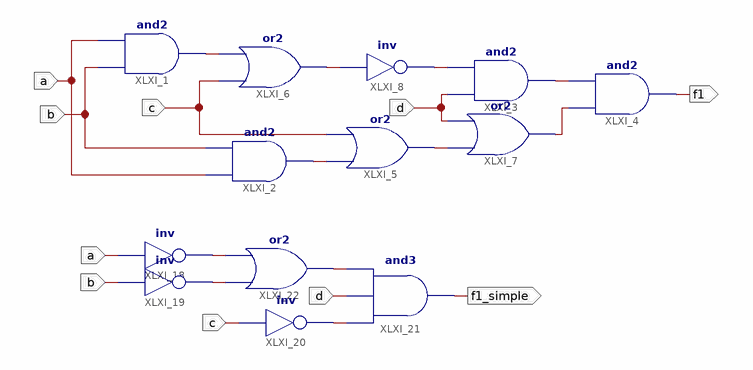
[diagram p0: schematic sheet 1]
// Xilinx ISE schematic problem_2_1.sch (spartan3e) as structural Verilog: 13 symbols, 6 ports
module problem_2_1 (
  input  c,
  input  d,
  input  a,
  input  b,
  output f1,
  output f1_simple
);

  wire XLXN_1, XLXN_2, XLXN_3, XLXN_5, XLXN_6, XLXN_7, XLXN_14, XLXN_22, XLXN_23, XLXN_24, XLXN_26;

  and XLXI_1 (XLXN_2, b, a);
  and XLXI_3 (XLXN_7, d, XLXN_6);
  and XLXI_4 (f1, XLXN_14, XLXN_7);
  or XLXI_6 (XLXN_5, c, XLXN_2);
  not XLXI_8 (XLXN_6, XLXN_5);
  and XLXI_2 (XLXN_1, a, b);
  or XLXI_5 (XLXN_3, XLXN_1, c);
  or XLXI_7 (XLXN_14, XLXN_3, d);
  and XLXI_21 (f1_simple, XLXN_26, d, XLXN_22);
  or XLXI_22 (XLXN_22, XLXN_24, XLXN_23);
  not XLXI_18 (XLXN_23, a);
  not XLXI_19 (XLXN_24, b);
  not XLXI_20 (XLXN_26, c);
endmodule
